# EAGLE schematic Logic level converter (EAGLE 6.4)
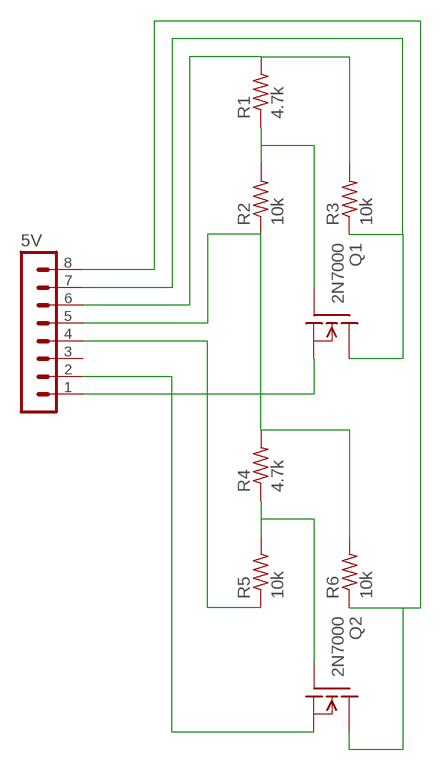
[diagram p0: schematic, sheet 1]

## Parts
5V  MA08-1W  [MA08-1W]
Q1  2N7000  BSS101  [TO92]
Q2  2N7000  BSS101  [TO92]
R1  4.7k  R-US_0204/2V  [0204V]
R2  10k  R-US_0204/2V  [0204V]
R3  10k  R-US_0204/2V  [0204V]
R4  4.7k  R-US_0204/2V  [0204V]
R5  10k  R-US_0204/2V  [0204V]
R6  10k  R-US_0204/2V  [0204V]

## Nets
3.3RX: 5V.2 Q2.1(S)
3.3TX: 5V.1 Q1.1(S)
5RX: 5V.7 Q1.3(D) R3.1
5TX: 5V.8 Q2.3(D) R6.1
5V: 5V.6 R1.2 R3.2
N$1: Q1.2(G) R1.1 R2.2
N$2: Q2.2(G) R4.1 R5.2
N$3: 5V.4 R5.1
N$6: 5V.5 R2.1 R4.2 R6.2
Unconnected: 5V.3

## Library data of the parts
5V = con-lstb:MA08-1W: PIN HEADER; OC_FARNELL: unknown; OC_NEWARK: unknown
Q1 Q2 = transistor-fet:BSS101: N-Channel Enhancement MOSFET 200V; 0,16A; 11Ohm
R1-R6 = rcl:R-US_: RESISTOR, American symbol